# Altium project Lab4_PAM_L06_BrodricYoung_Spencer.PrjPcb
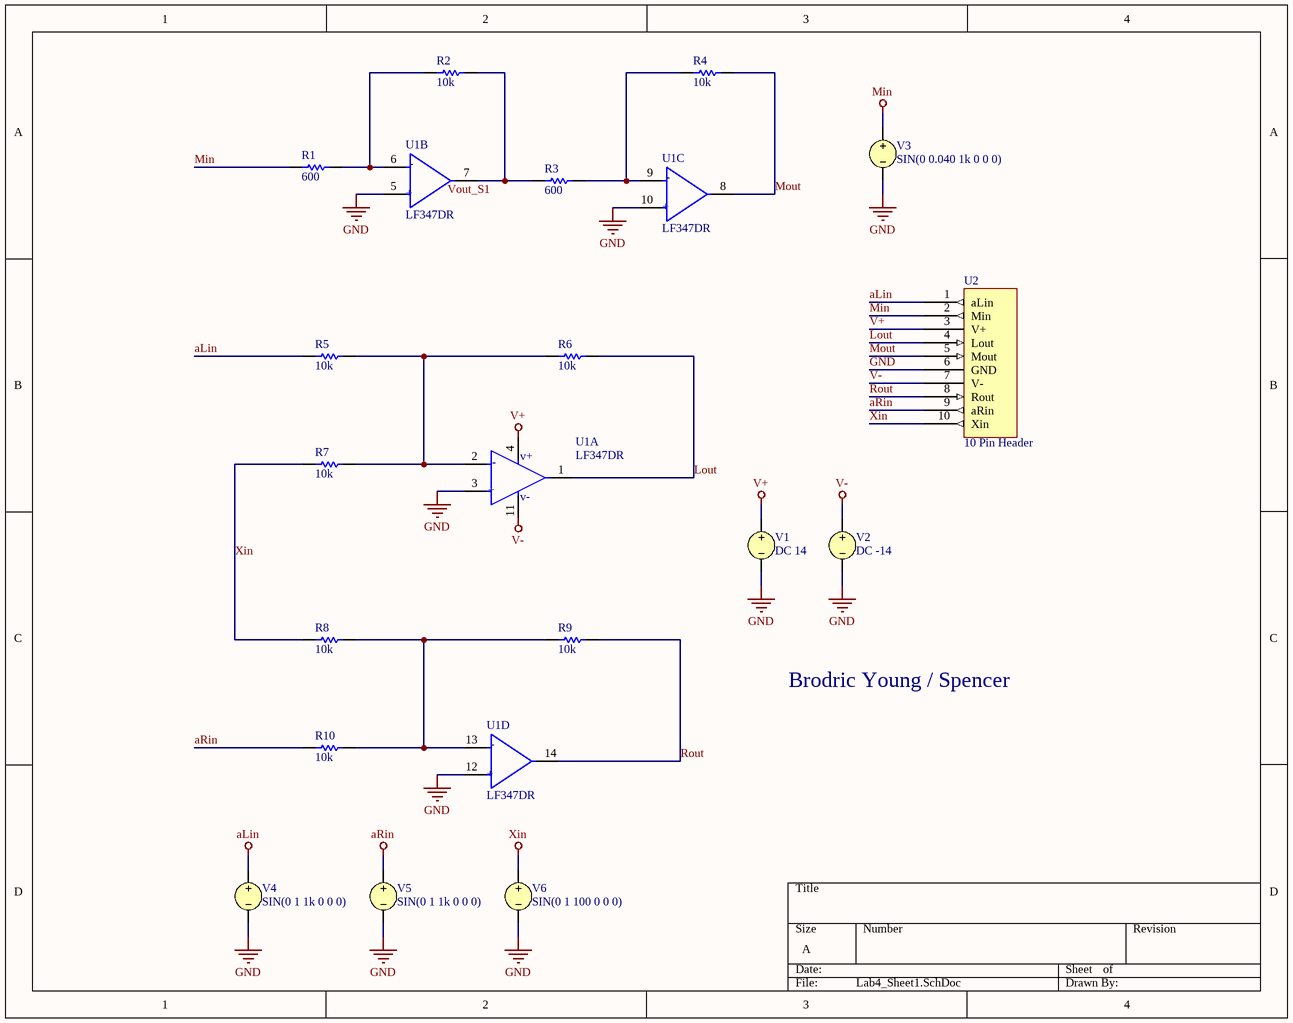
[diagram p0: Lab4_Sheet1.SchDoc]
1 sheet, 18 parts. Net scope: global (net labels, ports and power ports of the same name join across sheets).
Board file: Lab4_PCB1.PcbDoc

## Sheet Lab4_Sheet1.SchDoc
size A; SheetNumber: 1; SheetTotal: 1; SPICEModelCacheHVAQAZOF: <root> / <DocumentId>HVAQAZOF</DocumentId> / <CacheFrame Number="0"> / <Model Name="notsimulated" Kind="CKT"> / <Text>.SUBCKT NOTSIMULATED 1 / .ENDS NOTSIMULATED</Text> / </Model> / <Model Name="idealopamp_saturating" Kind="CKT"> / <Text>.SUBCKT IdealOpamp_Saturating  In+ In- VCC VEE Out PARAMS: GAIN=1Meg / RVCC VCC 0 350 / RVEE VEE 0 350 / E1 X 0 In+ In- {Gain} / B1 Out 0 V=IF(V(X) &gt; V(VCC), V(VCC), IF(V(X) &lt; V(VEE),V(VEE),V(X))) / R1 In- In+ 1e12 / .ENDS</Text> / </Model> / </CacheFrame> / </root>

### Parts
R1  value 600  [KBS_SMD0805]  (hidden comment: KBS_Resistor)
R2  value 10k  [KBS_SMD1206]  (hidden comment: KBS_Resistor)
R3  value 600  [KBS_SMD0805]  (hidden comment: KBS_Resistor)
R4  value 10k  [KBS_SMD1206]  (hidden comment: KBS_Resistor)
R5  value 10k  [KBS_SMD1206]  (hidden comment: KBS_Resistor)
R6  value 10k  [KBS_SMD1206]  (hidden comment: KBS_Resistor)
R7  value 10k  [KBS_SMD1206]  (hidden comment: KBS_Resistor)
R8  value 10k  [KBS_SMD1206]  (hidden comment: KBS_Resistor)
R9  value 10k  [KBS_SMD1206]  (hidden comment: KBS_Resistor)
R10  value 10k  [KBS_SMD1206]  (hidden comment: KBS_Resistor)
U1  LF347DR  [KBS_SO14_w_Guide_Pin_Holes]  (parts A,B,C,D of 4)
U2  10 Pin Header  [KBS_10pin_Header_PreA_Mixer]
V1  DC 14
V2  DC -14
V3  SIN(0 0.040 1k 0 0 0)
V4  SIN(0 1 1k 0 0 0)
V5  SIN(0 1 1k 0 0 0)
V6  SIN(0 1 100 0 0 0)

### Nets
aLin: R5.1 U2.1(aLin) V4.1
aRin: R10.1 U2.9(aRin) V5.1
GND: U1.3(1IN+) U1.5(2IN+) U1.10(3IN+) U1.12(4IN+) U2.6(GND) V1.2 V2.2 V3.2 V4.2 V5.2 V6.2
Min: R1.1 U2.2(Min) V3.1
V+: U1.4(VCC+) U2.3(V+) V1.1
V-: U1.11(VCC-) U2.7(V-) V2.1
Xin: R7.1 R8.1 U2.10(Xin) V6.1
Lout: R6.2 U1.1(1OUT) U2.4(Lout)
Mout: R4.2 U1.8(3OUT) U2.5(Mout)
Rout: R9.2 U1.14(4OUT) U2.8(Rout)
Vout_S1: R2.2 R3.1 U1.7(2OUT)
NetR1_2: R1.2 R2.1 U1.6(2IN-)
NetR3_2: R3.2 R4.1 U1.9(3IN-)
NetR5_2: R5.2 R6.1 R7.2 U1.2(1IN-)
NetR8_2: R8.2 R9.1 R10.2 U1.13(4IN-)

### Notes on the sheet
- Brodric Young / Spencer
- (in symbol CMP-014-00002-1, part A) v+; -; +; v-
- (in symbol CMP-014-00002-1, part B) -; +
- (in symbol CMP-014-00002-1, part C) -; +
- (in symbol CMP-014-00002-1, part D) -; +

### Library data of the parts
R1-R10 = CMP-009-00177-1: Fixed Resistor, 0.25W, 10000ohm, 200V, Surface Mount, 1206; Manufacturer: Yageo; Manufacturer Part Number: RC1206FR-0710KL; Tolerance: 1%; Power: 250mW; Pins: 2; RoHS Compliant: Yes; Max Operating Temperature: 155°C; Mounting Technology: Surface Mount; Min Operating Temperature: -55°C; Case/Package: 1206; Component Type: Resistors
U1 = CMP-014-00002-1: Operational Amplifier, 4 Func, 13000uV Offset-Max, JFET, PDSO14; Manufacturer: Texas Instruments; Nominal Supply Voltage: 15V; Channels: 4; Max Operating Temperature: 70°C; Min Operating Temperature: 0°C; RoHS Compliant: Yes; Pins: 14; Case/Package: SOP; Manufacturer Part Number: LF347DR; Component Type: Amplifiers
V1 = VSRC: Voltage Source; Note: PCB Footprint - Not required; AC Magnitude: 1; AC Phase: 0; Value: 14; Published: 8-Jun-2000; LatestRevisionDate: 17-Jul-2002; LatestRevisionNote: Re-released for DXP Platform.; PackageReference: Not Applicable; Publisher: Altium Limited
V2 = VSRC: Voltage Source; Note: PCB Footprint - Not required; AC Magnitude: 1; AC Phase: 0; Published: 8-Jun-2000; LatestRevisionDate: 17-Jul-2002; LatestRevisionNote: Re-released for DXP Platform.; PackageReference: Not Applicable; Publisher: Altium Limited; Value: -14
V3-V5 = VSRC: Voltage Source; Note: PCB Footprint - Not required; AC Magnitude: 1; AC Phase: 0; DC Magnitude: 5; Amplitude: 0.040; Published: 8-Jun-2000; LatestRevisionDate: 17-Jul-2002; LatestRevisionNote: Re-released for DXP Platform.; PackageReference: Not Applicable; Publisher: Altium Limited; Offset: 0; Frequency: 1k; Delay: 0; Damping Factor: 0; Phase: 0
V6 = VSRC: Voltage Source; Note: PCB Footprint - Not required; AC Magnitude: 1; AC Phase: 0; DC Magnitude: 5; Amplitude: 0.040; Frequency: 1k; Published: 8-Jun-2000; LatestRevisionDate: 17-Jul-2002; LatestRevisionNote: Re-released for DXP Platform.; PackageReference: Not Applicable; Publisher: Altium Limited; Offset: 0; Delay: 0; Damping Factor: 0; Phase: 0